# EAGLE schematic OPA381 (EAGLE 7.3.0)
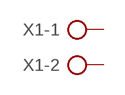
[diagram p0: schematic, sheet 1]

## Parts
X1  AK500/2  [AK500/2]
Unconnected: X1.1 X1.2

## Library data of the parts
X1 = con-ptr500:AK500/2: CONNECTOR; OC_FARNELL: unknown; OC_NEWARK: unknown